# EAGLE design rj45External (EAGLE 9.6.0)
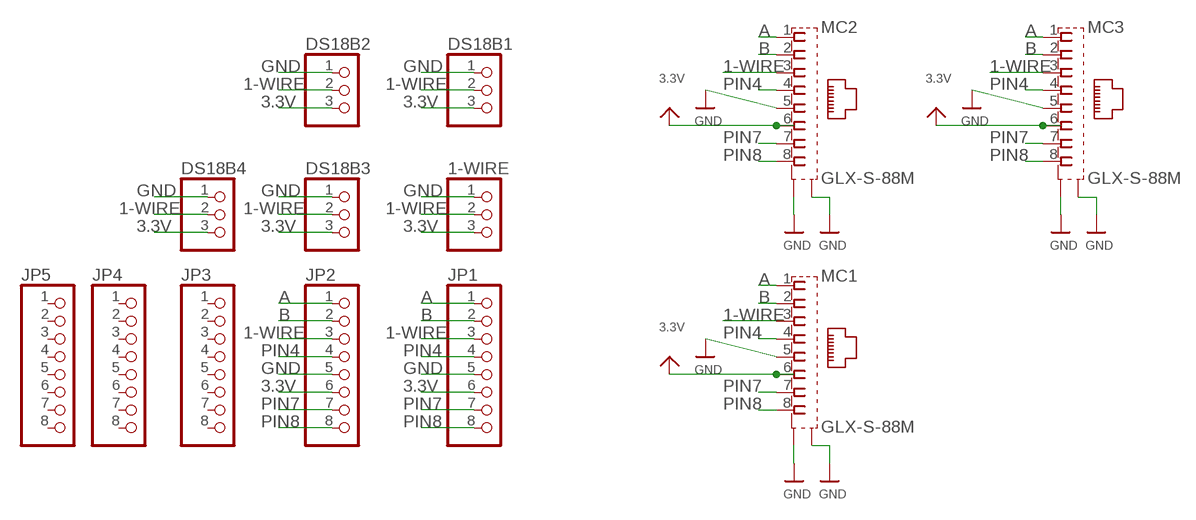
[diagram p0: schematic, sheet 1]

## Parts
1-WIRE  PINHD-1X3  [1X03]
DS18B1  PINHD-1X3  [1X03]
DS18B2  PINHD-1X3  [1X03]
DS18B3  PINHD-1X3  [1X03]
DS18B4  PINHD-1X3  [1X03]
JP1  PINHD-1X8BIG  [1X08-BIG]
JP2  PINHD-1X8BIG  [1X08-BIG]
JP3  PINHD-1X8BIG  [1X08-BIG]
JP4  PINHD-1X8BIG  [1X08-BIG]
JP5  PINHD-1X8BIG  [1X08-BIG]
MC1  GLX-S-88M  [GLX-S-88M]
MC2  GLX-S-88M  [GLX-S-88M]
MC3  GLX-S-88M  [GLX-S-88M]

## Nets
1-WIRE: 1-WIRE.2 DS18B1.2 DS18B2.2 DS18B3.2 DS18B4.2 JP1.3 JP2.3 MC1.3 MC2.3 MC3.3
3.3V: 1-WIRE.3 DS18B1.3 DS18B2.3 DS18B3.3 DS18B4.3 JP1.6 JP2.6 MC1.6 MC2.6 MC3.6
A [Diff]: JP1.1 JP2.1 MC1.1 MC2.1 MC3.1
B [Diff]: JP1.2 JP2.2 MC1.2 MC2.2 MC3.2
GND: 1-WIRE.1 DS18B1.1 DS18B2.1 DS18B3.1 DS18B4.1 JP1.5 JP2.5 MC1.5 MC1.S1 MC1.S2 MC2.5 MC2.S1 MC2.S2 MC3.5 MC3.S1 MC3.S2
PIN4: JP1.4 JP2.4 MC1.4 MC2.4 MC3.4
PIN7: JP1.7 JP2.7 MC1.7 MC2.7 MC3.7
PIN8: JP1.8 JP2.8 MC1.8 MC2.8 MC3.8
Unconnected: JP3.1 JP3.2 JP3.3 JP3.4 JP3.5 JP3.6 JP3.7 JP3.8 JP4.1 JP4.2 JP4.3 JP4.4 JP4.5 JP4.6 JP4.7 JP4.8 JP5.1 JP5.2 JP5.3 JP5.4 JP5.5 JP5.6 JP5.7 JP5.8

## Library data of the parts
1-WIRE DS18B1-DS18B4 = adafruit:PINHD-1X3: PIN HEADER
JP1-JP5 = adafruit:PINHD-1X8: PIN HEADER
MC1-MC3 = con-kycon:GLX-S-88M: Mod. Jack, Right Angle, 8 posiotion, 8 contatcs RJ45 Source: GLX-S-88M.pdf; OC_FARNELL: unknown; OC_NEWARK: unknown

## Net classes
1 Diff: width 0.203 mm

## Board
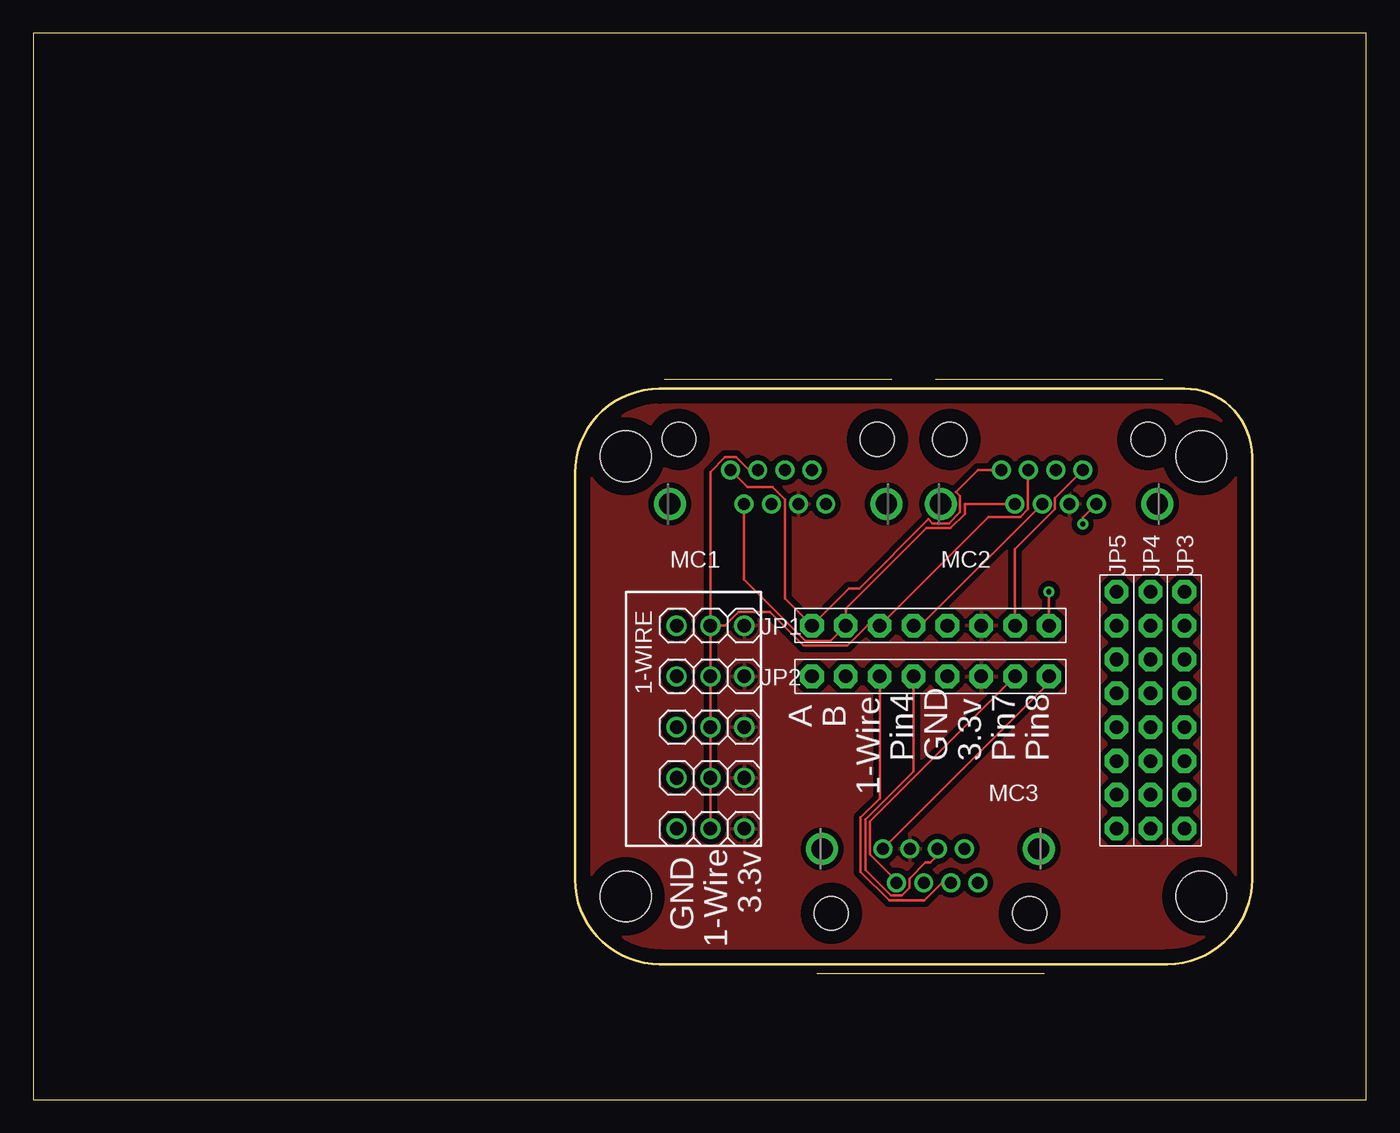
[diagram p1: board, top side]
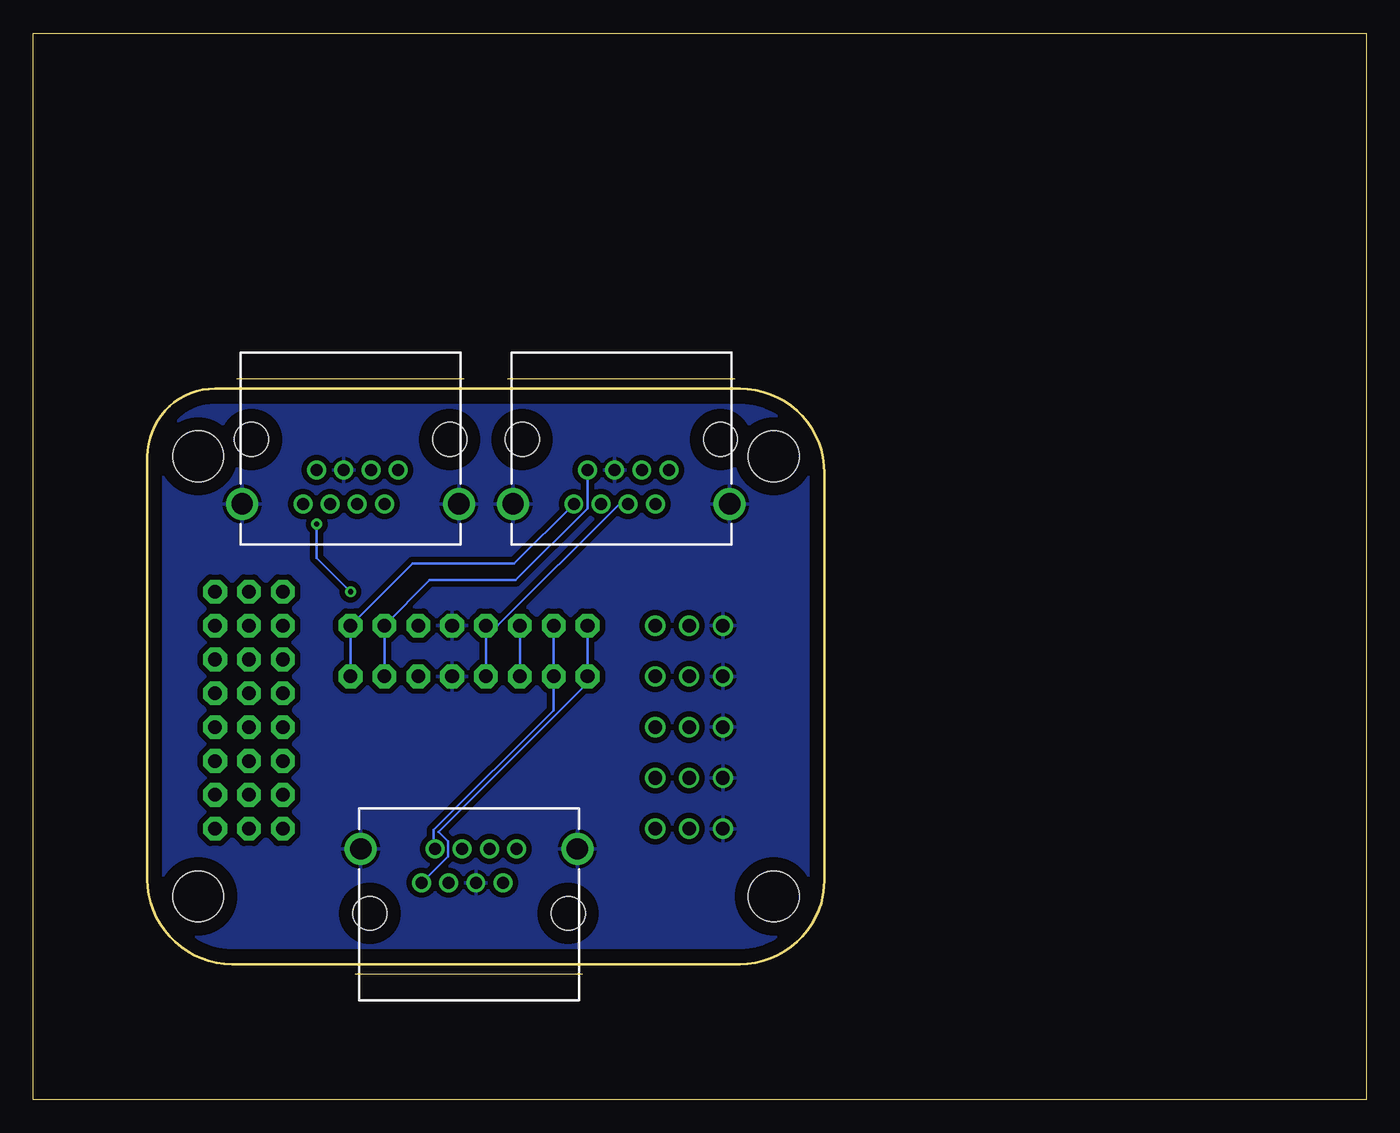
[diagram p2: board, bottom side, seen from below]

Size 100 x 80 mm. Coordinates in mm from the lower left corner, seen from the top.
Outline: 0,0 100,0 100,80 0,80 0,0
Outline: 46.99,53.34 arc90 40.64,46.99 40.64,16.51 arc90 46.99,10.16 85.09,10.16 arc90 91.44,16.51 91.44,48.26 arc90 86.36,53.34 46.99,53.34
Copper layers (1*16): Top 0.035mm / dielectric 1.5mm / Bottom 0.035mm
Design rules "default": minimum track width 6mil, minimum drill 0.35mm, track to track 6mil, track to pad 6mil, pad to pad 6mil, via to via 6mil, smd to smd 6mil, copper to edge 40mil, drill to drill 6mil, minimum pad ring 10mil, minimum via ring 8mil, stop-mask expansion 4mil, vias tented up to drill 0mil, thermal gap 10mil
Holes 3.81 mm at 44.45,48.26 87.63,48.26 87.63,15.24 44.45,15.24

### Footprints (pad centres in the part's own frame; a part is rotated, then mirrored left to right if it is on the bottom)
1X03 = drill 1.016: 1 -2.54,0; 2 0,0; 3 2.54,0
1X08-BIG = drill 1.016 pad 1.778 octagon: 1 -8.89,0; 2 -6.35,0; 3 -3.81,0; 4 -1.27,0; 5 1.27,0; 6 3.81,0; 7 6.35,0; 8 8.89,0
GLX-S-88M = drill 0.9 pad 1.422: 1 -3.57,-2.3; 2 -2.55,-4.84; 3 -1.53,-2.3; 4 -0.51,-4.84; 5 0.51,-2.3; 6 1.53,-4.84; 7 2.55,-2.3; 8 3.57,-4.84 | drill 1.6 pad 2.184: S1 -8.125,-4.84; S2 8.125,-4.84 | hole 2.55: -7.44,0; 7.44,0

### Placement (x,y rotation side)
1-WIRE  50.8,35.56 0 top
DS18B1  50.8,31.75 0 top
DS18B2  50.8,27.94 0 top
DS18B3  50.8,24.13 0 top
DS18B4  50.8,20.32 0 top
JP1  67.31,35.56 0 top
JP2  67.31,31.75 0 top
JP3  86.36,29.21 90 top
JP4  83.82,29.21 90 top
JP5  81.28,29.21 90 top
MC1  55.88,49.53 0 top
MC2  76.2,49.53 0 top
MC3  67.31,13.97 180 top

### Tracks (layer width: path | path; a pad name or v marks a point on that pad's centre or on a via)
1-WIRE
  Top 0.203: MC2.3 74.61,47.17 74.61,44.29 74.05,43.73 71.67,43.73 JP1.3 62.58,35.56 61.08,34.06 57.8,34.06 55.28,36.58 52.92,36.58 51.9,35.56 1-WIRE.2 | 1-WIRE.2 50.8,47.09 51.91,48.2 52.71,48.2 53.67,47.23 MC1.3 | 1-WIRE.2 DS18B1.2 DS18B2.2 DS18B3.2 DS18B4.2 | JP2.3 63.5,22.6 62.06,21.16 62.06,17.1 64.21,14.95 66.84,14.95 68.17,16.27 MC3.3
  Bottom 0.203: JP2.3 JP1.3
3.3V
  pour Top (isolate 0.406): 46.99,53.34 arc90 40.64,46.99 40.64,16.51 arc90 46.99,10.16 85.09,10.16 arc90 91.44,16.51 91.44,48.26 arc90 86.36,53.34
A
  Top 0.203: MC2.1 70.86,47.23 69.22,45.6 69.53,45.29 69.53,44.09 68.68,43.24 67.47,43.24 67.17,43.54 61.98,38.35 61.21,38.35 JP1.1 56.39,37.59 56.39,45.03 55.47,45.96 53.58,45.96 MC1.1
  Bottom 0.203: JP1.1 JP2.1 58.42,31.25 69.6,20.07 68.89,19.36 68.89,18.25 MC3.1
B
  Top 0.203: MC2.2 69.89,44.69 69.89,43.94 68.83,42.88 67.01,42.88 60.96,36.83 JP1.2 59.82,34.42 57.95,34.42 53.33,39.03 MC1.2
  Bottom 0.203: JP1.2 JP2.2 60.96,29.21 69.95,20.22 69.95,18.9 MC3.2
GND
  pour Bottom (isolate 0.406): 46.99,53.34 arc90 40.64,46.99 40.64,16.51 arc90 46.99,10.16 85.09,10.16 arc90 91.44,16.51 91.44,48.26 arc90 86.36,53.34
PIN4
  Top 0.203: MC2.4 66.56,35.56 JP1.4 | JP2.4 66.04,24.63 62.42,21.01 62.42,17.25 64.36,15.3 65.16,15.3 65.72,15.87 65.72,16.56 66.94,17.78 67.31,17.78 67.82,18.29 MC3.4
  Bottom 0.203: MC1.4 56.02,44.69 65.15,35.56 JP1.4 JP2.4
PIN7
  Top 0.203: MC2.7 76.66,45.13 76.66,44.29 73.66,41.3 JP1.7 | JP2.7 62.77,20.86 62.77,18.41 64.76,16.43 MC3.7
  Bottom 0.203: MC1.7 58.43,44.34 63.81,38.97 70.25,38.97 JP1.7 JP2.7
PIN8  (via drill 0.39)
  Top 0.203: JP2.8 76.2,31.27 MC3.8 | MC2.8 78.74,43.66 v78.74,43.18 | v76.2,38.1 JP1.8
  Bottom 0.203: MC1.8 63.92,40.22 71.54,40.22 JP1.8 JP2.8 | v78.74,43.18 78.74,40.64 v76.2,38.1

### Text on the board
tNames: A | B | Pin4 | GND | 3.3v | Pin7 | Pin8 | 1-Wire | 3.3v | GND | 1-Wire